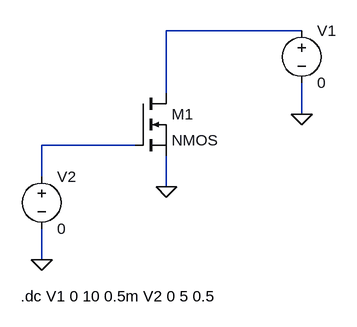
[diagram p0: schematic NMOS.asc]
NMOS.asc, the LTspice schematic file:
Version 4
SHEET 1 880 680
WIRE 416 0 208 0
WIRE 208 96 208 0
WIRE 416 128 416 80
WIRE 160 176 16 176
WIRE 16 224 16 176
WIRE 208 240 208 192
WIRE 16 352 16 304
FLAG 16 352 0
FLAG 416 128 0
FLAG 208 240 0
SYMBOL voltage 416 -16 R0
WINDOW 123 0 0 Left 0
WINDOW 39 0 0 Left 0
SYMATTR InstName V1
SYMATTR Value 0
SYMBOL voltage 16 208 R0
WINDOW 123 0 0 Left 0
WINDOW 39 0 0 Left 0
SYMATTR InstName V2
SYMATTR Value 0
SYMBOL nmos 160 96 R0
SYMATTR InstName M1
TEXT -16 408 Left 2 !.dc V1 0 10 0.5m V2 0 5 0.5

The netlist it stands for:
* NMOS.asc
V1 N001 0 0
V2 N002 0 0
M1 N001 N002 0 0 NMOS
.model NMOS NMOS
.model PMOS PMOS
.lib standard.mos
.dc V1 0 10 0.5m V2 0 5 0.5
.backanno
.end